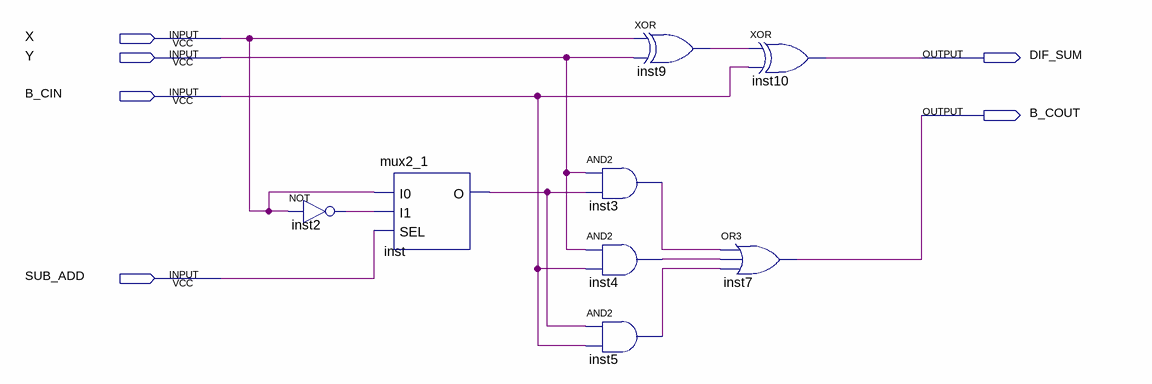
[diagram p0: schematic sheet]
// Quartus schematic fullSubAdd.bdf as structural Verilog: 8 symbols, 6 pins
module fullSubAdd (
  input  X,
  input  Y,
  input  B_CIN,
  input  SUB_ADD,
  output DIF_SUM,
  output B_COUT
);

  wire inst2_out, inst3_out, inst4_out, inst5_out, inst9_out, inst_o;

  not inst2 (inst2_out, X);
  mux2_1 inst (.I0(X), .I1(inst2_out), .SEL(SUB_ADD), .O(inst_o));
  and inst3 (inst3_out, Y, inst_o);
  and inst4 (inst4_out, Y, B_CIN);
  and inst5 (inst5_out, inst_o, B_CIN);
  xor inst9 (inst9_out, X, Y);
  xor inst10 (DIF_SUM, inst9_out, B_CIN);
  or inst7 (B_COUT, inst3_out, inst4_out, inst5_out);
endmodule
